# Altium schematic sheet 02 - Block Diagram.SchDoc: Block Diagram
size 386 x 246 mm; Date:: Friday, Nov 22, 2019; Page Number: 2; Page Size: B; Comment: Lattice Title Block New Brand; Page Count: 14; Board Rev: B; Project Name: CrossLink-NX Evaluation Board; RevCode: 1.0; Doc: 305-PD-19-0819; DsnPath: C:\Users\HAltinkilit\Downloads\Crosslink-NX-Design-Files\CrossLink-NX-Eval-Brd-Schematic-RevB-191122.DSN; SchematicName: SCHEMATIC1; PageName: 02 - Block Diagram; PageSize: B; TopSchematic: True
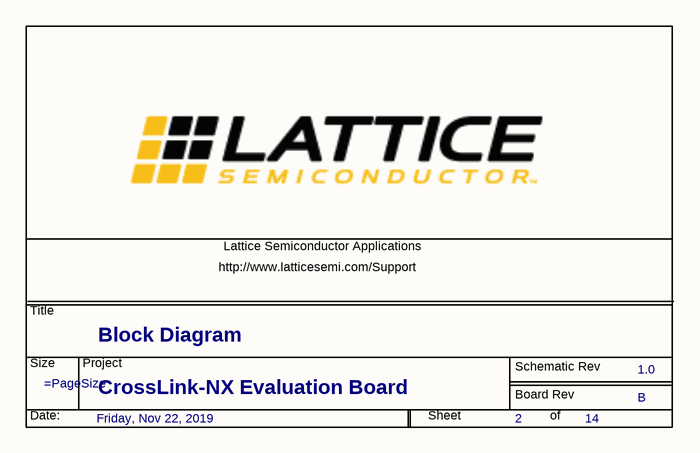
[diagram p0: 02 - Block Diagram.SchDoc]

## Parts
*  Board Rev: B  Date:: Friday, Nov 22, 2019  RevCode: 1.0  Page Count: 14  Page Number: 2  Title: Block Diagram  Project Name: CrossLink-NX Evaluation Board  (hidden comment: Lattice Title Block New Brand)  (graphical)

## Notes on the sheet
- (in symbol Lattice Title Block New Brand) Lattice Semiconductor Applications; http://www.latticesemi.com/Support; Title; Size; Project; Schematic Rev; Board Rev; Date:; Sheet; of

## Library data of the parts
* = Lattice Title Block New Brand: Doc: 305-PD-19-0819; Page Size: =PageSize